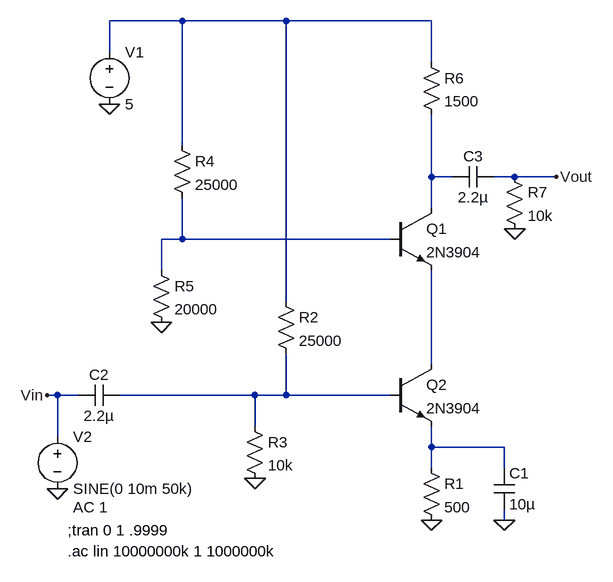
[diagram p0: schematic 04B-340.asc]
04B-340.asc, the LTspice schematic file:
Version 4
SHEET 1 880 696
WIRE -160 -144 -272 -144
WIRE 0 -144 -160 -144
WIRE 224 -144 0 -144
WIRE -272 -96 -272 -144
WIRE 224 -80 224 -144
WIRE -160 48 -160 -144
WIRE 224 96 224 0
WIRE 256 96 224 96
WIRE 352 96 320 96
WIRE 416 96 352 96
WIRE 224 144 224 96
WIRE -160 192 -160 128
WIRE -160 192 -192 192
WIRE 160 192 -160 192
WIRE -192 240 -192 192
WIRE 0 288 0 -144
WIRE 224 384 224 240
WIRE -352 432 -368 432
WIRE -320 432 -352 432
WIRE -48 432 -256 432
WIRE 0 432 0 368
WIRE 0 432 -48 432
WIRE 160 432 0 432
WIRE -48 480 -48 432
WIRE -352 496 -352 432
WIRE 224 512 224 480
WIRE 336 512 224 512
WIRE 224 544 224 512
WIRE 336 544 336 512
WIRE 336 624 336 608
FLAG -192 320 0
FLAG -272 -16 0
FLAG 416 96 Vout
FLAG 224 624 0
FLAG 336 624 0
FLAG -48 560 0
FLAG -368 432 Vin
FLAG -352 576 0
FLAG 352 176 0
SYMBOL npn 160 144 R0
SYMATTR InstName Q1
SYMATTR Value 2N3904
SYMBOL res -176 32 R0
SYMATTR InstName R4
SYMATTR Value 25000
SYMBOL res -208 224 R0
SYMATTR InstName R5
SYMATTR Value 20000
SYMBOL res 208 -96 R0
SYMATTR InstName R6
SYMATTR Value 1500
SYMBOL voltage -272 -112 R0
WINDOW 123 0 0 Left 0
WINDOW 39 0 0 Left 0
SYMATTR InstName V1
SYMATTR Value 5
SYMBOL npn 160 384 R0
SYMATTR InstName Q2
SYMATTR Value 2N3904
SYMBOL res 208 528 R0
SYMATTR InstName R1
SYMATTR Value 500
SYMBOL cap 320 544 R0
SYMATTR InstName C1
SYMATTR Value 10µ
SYMBOL cap -256 416 R90
WINDOW 0 0 32 VBottom 2
WINDOW 3 32 32 VTop 2
SYMATTR InstName C2
SYMATTR Value 2.2µ
SYMBOL res -16 272 R0
SYMATTR InstName R2
SYMATTR Value 25000
SYMBOL res -64 464 R0
SYMATTR InstName R3
SYMATTR Value 10k
SYMBOL voltage -352 480 R0
WINDOW 123 24 124 Left 2
WINDOW 39 0 0 Left 0
SYMATTR Value2 AC 1
SYMATTR InstName V2
SYMATTR Value SINE(0 10m 50k)
SYMBOL cap 320 80 R90
WINDOW 0 0 32 VBottom 2
WINDOW 3 32 32 VTop 2
SYMATTR InstName C3
SYMATTR Value 2.2µ
SYMBOL res 336 80 R0
SYMATTR InstName R7
SYMATTR Value 10k
TEXT -336 640 Left 2 !;tran 0 1 .9999
TEXT -336 672 Left 2 !.ac lin 10000000k 1 1000000k

The netlist it stands for:
* 04B-340.asc
Q1 N002 N003 N004 0 2N3904
R4 N001 N003 25000
R5 N003 0 20000
R6 N001 N002 1500
V1 N001 0 5
Q2 N004 N005 N006 0 2N3904
R1 N006 0 500
C1 N006 0 10µ
C2 N005 Vin 2.2µ
R2 N001 N005 25000
R3 N005 0 10k
V2 Vin 0 SINE(0 10m 50k) AC 1
C3 Vout N002 2.2µ
R7 Vout 0 10k
.model NPN NPN
.model PNP PNP
.lib standard.bjt
;tran 0 1 .9999
.ac lin 10000000k 1 1000000k
.backanno
.end